# EAGLE design SparkFun_PiMicro-RP2040 (EAGLE 9.6.2)
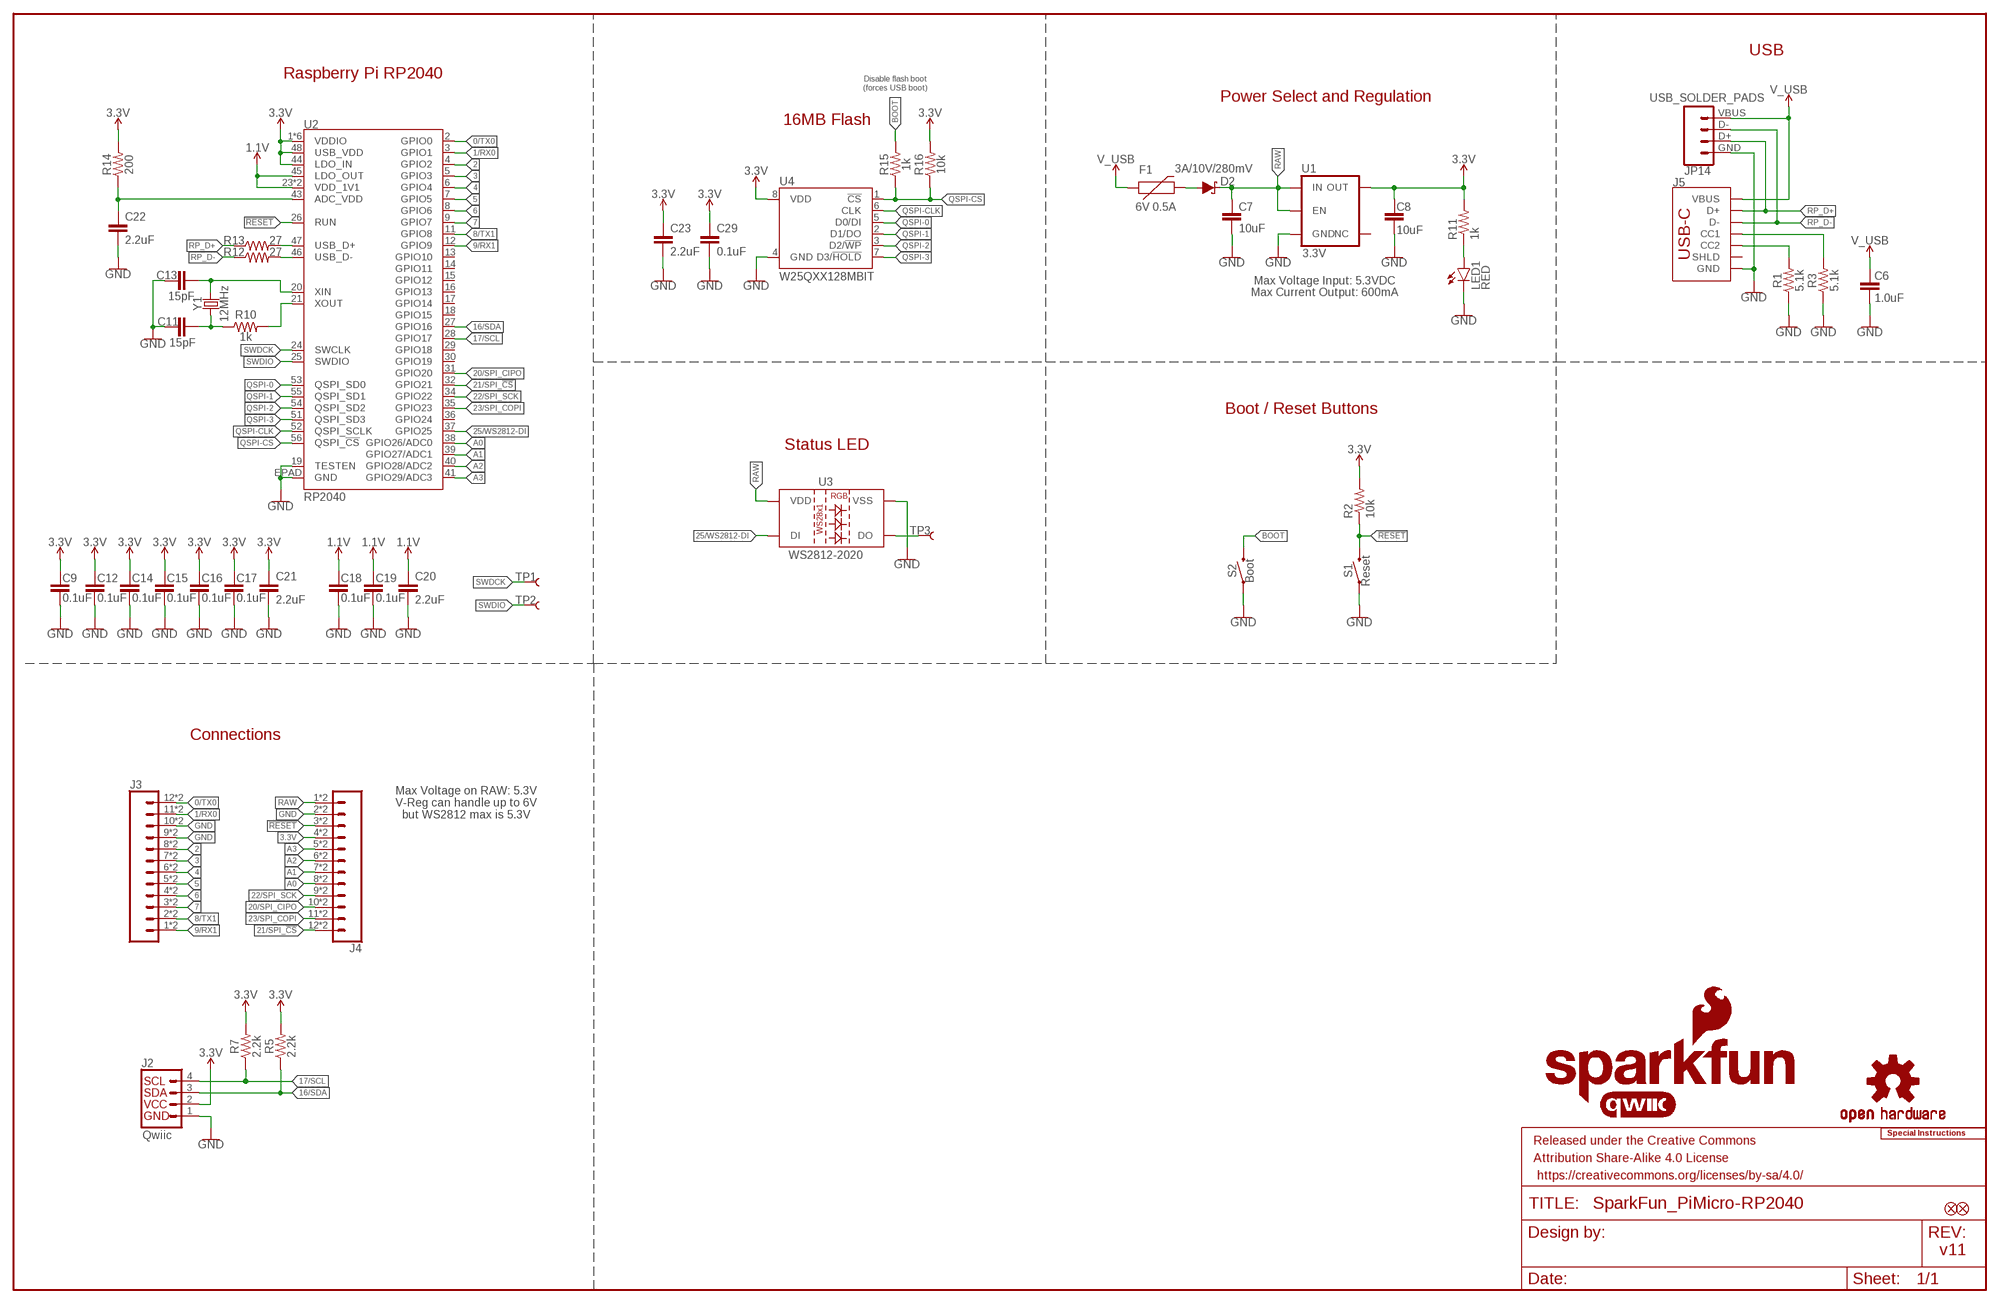
[diagram p0: schematic, sheet 1]

## Parts
C6  1.0uF  1.0UF-0402T-16V-10%  [0402-TIGHT]
C7  10uF  10UF-0402T-6.3V-20%  [0402-TIGHT]
C8  10uF  10UF-0402T-6.3V-20%  [0402-TIGHT]
C9  0.1uF  0.1UF-0402T-6.3V-10%-X7R  [0402-TIGHT]
C11  15pF  15PF-0402T-50V-5%  [0402-TIGHT]
C12  0.1uF  0.1UF-0402T-6.3V-10%-X7R  [0402-TIGHT]
C13  15pF  15PF-0402T-50V-5%  [0402-TIGHT]
C14  0.1uF  0.1UF-0402T-6.3V-10%-X7R  [0402-TIGHT]
C15  0.1uF  0.1UF-0402T-6.3V-10%-X7R  [0402-TIGHT]
C16  0.1uF  0.1UF-0402T-6.3V-10%-X7R  [0402-TIGHT]
C17  0.1uF  0.1UF-0402T-6.3V-10%-X7R  [0402-TIGHT]
C18  0.1uF  0.1UF-0402T-6.3V-10%-X7R  [0402-TIGHT]
C19  0.1uF  0.1UF-0402T-6.3V-10%-X7R  [0402-TIGHT]
C20  2.2uF  2.2UF-0402_TIGHT-10V-10%-X5R  [0402-TIGHT]
C21  2.2uF  2.2UF-0402_TIGHT-10V-10%-X5R  [0402-TIGHT]
C22  2.2uF  2.2UF-0402_TIGHT-10V-10%-X5R  [0402-TIGHT]
C23  2.2uF  2.2UF-0402_TIGHT-10V-10%-X5R  [0402-TIGHT]
C29  0.1uF  0.1UF-0402T-6.3V-10%-X7R  [0402-TIGHT]
D2  3A/10V/280mV  DIODE-SCHOTTKY-BAT60A  [SOD-323]
F1  6V 0.5A  PPTC_6V500MA  [0805]
FRAME2  FRAME-LEDGER  [CREATIVE_COMMONS]
J2  Qwiic  QWIIC_CONNECTORJS-1MM  [JST04_1MM_RA]
J3  CONN_12CASTLE  [1X12_CASTELLATED]
J4  CONN_12CASTLE  [1X12_CASTELLATED]
J5  USB Female Type C Connector  USB_C_4-LAYER_PADS  [USB-C-16P_4LAYER-PADS]
JP1  FIDUCIAL1X2  [FIDUCIAL-1X2]
JP2  FIDUCIAL1X2  [FIDUCIAL-1X2]
JP14  USB_SOLDER_PADS  [USB-SOLDER-PADS]
LED1  RED  LED-RED0603  [LED-0603]
LOGO1  SFE_LOGO_NAME_FLAME.1_INCH  [SFE_LOGO_NAME_FLAME_.1]
LOGO3  QWIIC_LOGO_6MM  [QWIIC_6MM]
LOGO4  SFE_LOGO_FLAME.1_INCH  [SFE_LOGO_FLAME_.1]
LOGO5  SPECIAL_INSTRUCTIONS-ORDERING  [ORDERING_INSTRUCTIONS]
R1  5.1k  5.1KOHM-0402T-1/16W-1%  [0402-TIGHT]
R2  10k  10KOHM-0402T-1/16W-1%  [0402-TIGHT]
R3  5.1k  5.1KOHM-0402T-1/16W-1%  [0402-TIGHT]
R5  2.2k  2.2KOHM-0402T-1/16W-1%  [0402-TIGHT]
R7  2.2k  2.2KOHM-0402T-1/16W-1%  [0402-TIGHT]
R10  1k  1KOHM-0402T-1/16W-1%  [0402-TIGHT]
R11  1k  1KOHM-0402T-1/16W-1%  [0402-TIGHT]
R12  27  27OHM  [0402-TIGHT]
R13  27  27OHM  [0402-TIGHT]
R14  200  200OHM-0402T-1/16W-1%  [0402-TIGHT]
R15  1k  1KOHM-0402T-1/16W-1%  [0402-TIGHT]
R16  10k  10KOHM-0402T-1/16W-1%  [0402-TIGHT]
S1  Reset  MOMENTARY-SWITCH-SPST-SMD-4.6X2.8MM  [TACTILE_SWITCH_SMD_4.6X2.8MM]
S2  Boot  MOMENTARY-SWITCH-SPST-SMD-4.6X2.8MM  [TACTILE_SWITCH_SMD_4.6X2.8MM]
TP1  TEST-POINT3X5  [PAD.03X.05]
TP2  TEST-POINT3X5  [PAD.03X.05]
TP3  TEST-POINT3X5  [PAD.03X.05]
U1  3.3V  V_REG_AP2112K-3.3V  [SOT23-5]
U2  RP2040  [QFN-56]
U3  WS2812-2020  [WS2812-2020]
U4  W25QXX128MBIT  W25QXX128MBIT-6X5-SKINNY_CENTER  [WSON-8-6X5-SKINNY_CENTERPAD]
U$3  OSHW-LOGOMINI  [OSHW-LOGO-MINI]
Y1  12MHz  CRYSTAL-12MHZ  [CRYSTAL-SMD-2X2.5MM]

## Nets
0/TX0: J3.12 J3.12B U2.2(GPIO0)
1.1V: C18.1 C19.1 C20.1 U2.23(VDD_1V1) U2.45(LDO_OUT) U2.50(VDD_1V1)
1/RX0: J3.11 J3.11B U2.3(GPIO1)
2: J3.8 J3.8B U2.4(GPIO2)
3: J3.7 J3.7B U2.5(GPIO3)
3.3V: C8.2 C9.1 C12.1 C14.1 C15.1 C16.1 C17.1 C21.1 C23.1 C29.1 J2.2 J4.4 J4.4B R2.2 R5.2 R7.2 R11.2 R14.2 R16.2 U1.5(OUT) U2.1(VDDIO) U2.10(VDDIO) U2.22(VDDIO) U2.33(VDDIO) U2.42(VDDIO) U2.44(LDO_IN) U2.48(USB_VDD) U2.49(VDDIO) U4.8(VDD)
4: J3.6 J3.6B U2.6(GPIO4)
5: J3.5 J3.5B U2.7(GPIO5)
6: J3.4 J3.4B U2.8(GPIO6)
7: J3.3 J3.3B U2.9(GPIO7)
8/TX1: J3.2 J3.2B U2.11(GPIO8)
9/RX1: J3.1 J3.1B U2.12(GPIO9)
16/SDA: J2.3 R5.1 U2.27(GPIO16)
17/SCL: J2.4 R7.1 U2.28(GPIO17)
20/SPI_CIPO: J4.10 J4.10B U2.31(GPIO20)
21/SPI_!CS!: J4.12 J4.12B U2.32(GPIO21)
22/SPI_SCK: J4.9 J4.9B U2.34(GPIO22)
23/SPI_COPI: J4.11 J4.11B U2.35(GPIO23)
25/WS2812-DI: U2.37(GPIO25) U3.3(DI)
!RESET!: J4.3 J4.3B R2.1 S1.3 S1.4 U2.26(RUN)
A0: J4.8 J4.8B U2.38(GPIO26/ADC0)
A1: J4.7 J4.7B U2.39(GPIO27/ADC1)
A2: J4.6 J4.6B U2.40(GPIO28/ADC2)
A3: J4.5 J4.5B U2.41(GPIO29/ADC3)
ADC_VDD: C22.1 R14.1 U2.43(ADC_VDD)
BOOT: R15.2 S2.3 S2.4
GND: C6.1 C7.1 C8.1 C9.2 C11.1 C12.2 C13.1 C14.2 C15.2 C16.2 C17.2 C18.2 C19.2 C20.2 C21.2 C22.2 C23.2 C29.2 J2.1 J3.9 J3.9B J3.10 J3.10B J4.2 J4.2B J5.GND J5.GND2(GND) JP14.GND LED1.C R1.1 R3.1 S1.1 S1.2 S2.1 S2.2 U1.2(GND) U2.19(TESTEN) U2.EPAD(GND) U3.2(VSS) U4.4(GND)
N$1: TP3.P$1 U3.1(DO)
N$9: J5.A5(CC1) R3.2
N$10: J5.B5(CC2) R1.2
N$38: LED1.A R11.1
QSPI-0: U2.53(QSPI_SD0) U4.5(D0/DI)
QSPI-1: U2.55(QSPI_SD1) U4.2(D1/DO)
QSPI-2: U2.54(QSPI_SD2) U4.3(D2/!WP!)
QSPI-3: U2.51(QSPI_SD3) U4.7(D3/!HOLD!)
QSPI-CLK: U2.52(QSPI_SCLK) U4.6(CLK)
QSPI-CS: R15.1 R16.1 U2.56(QSPI_!CS!) U4.1(!CS!)
RAW [Power]: C7.2 D2.C J4.1 J4.1B U1.1(IN) U1.3(EN) U3.4(VDD)
RP_D1+: R13.2 U2.47(USB_D+)
RP_D1-: R12.2 U2.46(USB_D-)
RP_D+: J5.A6(D+) J5.B6(D+) JP14.D+ R13.1
RP_D-: J5.A7(D-) J5.B7(D-) JP14.D- R12.1
SWDCK: TP1.P$1 U2.24(SWCLK)
SWDIO: TP2.P$1 U2.25(SWDIO)
USB_RAW [Power]: D2.A F1.2
V_USB [Power]: C6.2 F1.1 J5.VBUS1(VBUS) J5.VBUS2(VBUS) JP14.VBUS
X1A: R10.2 U2.21(XOUT)
X1B: C11.2 R10.1 Y1.P1
X2: C13.2 U2.20(XIN) Y1.P3
Unconnected: J5.SHLD1(SHLD) J5.SHLD2(SHLD) J5.SHLD3(SHLD) J5.SHLD4(SHLD) U1.4(NC) U2.13(GPIO10) U2.14(GPIO11) U2.15(GPIO12) U2.16(GPIO13) U2.17(GPIO14) U2.18(GPIO15) U2.29(GPIO18) U2.30(GPIO19) U2.36(GPIO24)

## Notes on the sheet
- USB
- Raspberry Pi RP2040
- Disable flash boot
  (forces USB boot)
- Power Select and Regulation
- 16MB Flash
- Max Voltage Input: 5.3VDC
- Max Current Output: 600mA
- Boot / Reset Buttons
- Status LED
- Connections
- Max Voltage on RAW: 5.3V
  V-Reg can handle up to 6V
  but WS2812 max is 5.3V
- v11

## Library data of the parts
C6 = SparkFun-Capacitors:1.0UF: 1µF ceramic capacitors A capacitor is a passive two-terminal electrical component used to store electrical energy temporarily in an electric field.; PROD_ID: CAP-12417
C7 C8 = SparkFun-Capacitors:10UF: 10.0µF ceramic capacitors A capacitor is a passive two-terminal electrical component used to store electrical energy temporarily in an electric field.; PROD_ID: CAP-14848
C9 C12 C14-C19 C29 = SparkFun-Capacitors:0.1UF: 0.1µF ceramic capacitors A capacitor is a passive two-terminal electrical component used to store electrical energy temporarily in an electric field.; PROD_ID: CAP-14993
C11 C13 = SparkFun-Capacitors:15PF: 15pF ceramic capacitors A capacitor is a passive two-terminal electrical component used to store electrical energy temporarily in an electric field.; PROD_ID: CAP-13063
C20-C23 = SparkFun-Capacitors:2.2UF: 2.2µF ceramic capacitors A capacitor is a passive two-terminal electrical component used to store electrical energy temporarily in an electric field.; PROD_ID: CAP-14232
D2 = SparkFun-DiscreteSemi:DIODE-SCHOTTKY: Schottky diode A Schottky diode is a semiconductor diode which has a low forward voltage drop and a very fast switching action.; PROD_ID: DIO-14072
F1 = SparkFun-Fuses:PPTC: Resettable Fuse PPTC Resettable Fuse. Really a sort of resistor with a polymeric positive temperature coefficient whose resistance increases dramatically with an increase in temperature. When heated by the power passing through the resistance rises causing the current to be limited, protecting the circuit. This is achieved by the transition of the polymer from a crystalline to an amorphous state where the conductive carbon separates breaking the conductive pathways found in the cool crystalline structure. When a PPTC cools back down it resumes conducting letting the circuit turn back on. SparkFun Products: SparkFun RedBoard - Programmed with Arduino <https://www.sparkfun.com/products/12757> Pro Micro - 5V/16MHz <https://www.sparkfun.com/products/12640> Arduino Pro 328 - 5V/16MHz <https://www.sparkfun.com/products/10915> MP3 Trigger <https://www.sparkfun.com/products/13720>; PROD_ID: RES-13945
FRAME2 = SparkFun-Aesthetics:FRAME-LEDGER: Schematic Frame - Ledger Standard 11x14 US Ledger frame
J2 = SparkFun-Connectors:QWIIC_CONNECTOR: SparkFun I2C Standard Qwiic Connector An SMD 1mm pitch JST connector makes it easy and quick (get it? Qwiic?) to connect I2C devices to each other. The Qwiic system <http://www.sparkfun.com/qwiic> enables fast and solderless connection between popular platforms and various sensors and actuators. We carry 200mm <https://www.sparkfun.com/products/14204>, 100mm <https://www.sparkfun.com/products/14205>, 50mm <https://www.sparkfun.com/products/14206>, and breadboard friendly <https://www.sparkfun.com/products/14207> Qwiic cables. We also offer 10 pcs strips <https://www.sparkfun.com/products/14323> the SMD connectors.; PROD_ID: CONN-13694; VALUE: QWIIC_RIGHT_ANGLE
J3 J4 = Castellated:CONN_12: Multi connection point. Often used as Generic Header-pin footprint for 0.1 inch spaced/style header connections On any of the 0.1 inch spaced packages, you can populate with these: Break Away Headers - Straight <https://www.sparkfun.com/products/116> (PRT-00116) Break Away Male Headers - Right Angle <https://www.sparkfun.com/products/553> (PRT-00553) Female Headers <https://www.sparkfun.com/products/115> (PRT-00115) Break Away Headers - Machine Pin <https://www.sparkfun.com/products/117> (PRT-00117) Break Away Female Headers - Swiss Machine Pin <https://www.sparkfun.com/products/743> (PRT-00743) For SCREWTERMINALS and SPRING TERMINALS visit here: Screw Terimnals on SparkFun.com <https://www.sparkfun.com/search/results?term=Screw+Terminals> (5mm/3.5mm/2.54mm spacing) This device is also useful as a general connection point to wire up your design to another part of your project. Our various solder wires solder well into these plated through hole pads. Hook-Up Wire - Assortment (Stranded, 22 AWG) <https://www.sparkfun.com/products/11375> (PRT-11375) Hook-Up Wire - Assortment (Solid Core, 22 AWG) <https://www.sparkfun.com/products/11367> (PRT-11367) View the entire wire category on our website here <https://www.sparkfun.com/categories/141> Special notes: Molex polarized connector foot print use with SKU : PRT-08231 with associated crimp pins and housings. 1MM SMD Version SKU: PRT-10208 NOTES ON THE VARIANTS LOCK and LOCK_LONGPADS... This footprint was designed to help hold the alignment of a through-hole component (i.e. 6-pin header) while soldering it into place. You may notice that each hole has been shifted either up or down by 0.005 of an inch from it's more standard position (which is a perfectly straight line). This slight alteration caused the pins (the squares in the middle) to touch the edges of the holes. Because they are alternating, it causes a "brace" to hold the component in place. 0.005 has proven to be the perfect amount of "off-center" position when using our standard breakaway headers. Although looks a little odd when you look at the bare footprint, once you have a header in there, the alteration is very hard to notice. Also,if you push a header all the way into place, it is covered up entirely on the bottom side.
J5 = SparkFun-Connectors:USB_C: USB Type C 16Pin Connector Super Speed pins not available on the 16-pin purely SMD connector so this part is best for USB 2.0 implementations. D1 and D2 are tied together enabling D+/- no matter which way the cable is plugged into the connector. The two channel configuration pins (CC1/2) are exposed. These are normally connected to ground via 5.1k resistors but can be reconfigured for high current/high power applications. **4-LAYER BOARD WARNING!!** If designing 4-layer board, make sure to select the variant _4-LAYER-ISOLATED. The linked footprint (USB-C-16-4LAYER-ISOLATED) includes some very necessary cutout polygons in the inner layers (2 and 15). This prevents the PTH mounting shield legs on the USB connector from electrically connecting any other polygons on the inner layers (usually VCC and GND).; PROD_ID: CONN-14122
JP1 JP2 = SparkFun-Aesthetics:FIDUCIAL: Fiducial Alignment Points Point-of-reference for pick-and-place machines and other optical instruments.
JP14 = SparkFun-Connectors:USB_SOLDER_PADS: Solder pad access to USB pins. Helpful to expose on PCBs so user can attach external USB connector if necessary.
LED1 = SparkFun-LED:LED-RED: Red SMD LED Used in manufacturing of most products at SparkFun Packages: 0603 - SMD 0603 package [Product Link] <http://docs.avagotech.com/docs/AV02-0551EN> 0603 SMART - SMD 0603 SMART package ( more efficient and expensive)[Product Link] <http://www.osram-os.com/Graphics/XPic2/00077099_0.pdf> 1206 - SMD1206 package [Product Link] <https://www.sparkfun.com/datasheets/DevTools/LilyPad/Q150OVS4.pdff> SparkFun Products: Pro Mini 328 -5V <https://www.sparkfun.com/products/821> RedBoard <https://www.sparkfun.com/products/12757> IOIO-OTG <https://www.sparkfun.com/products/13613>; PROD_ID: DIO-00819
LOGO1 = SparkFun-Aesthetics:SFE_LOGO_NAME_FLAME: SparkFun Font Logo w/ Flame This is the SparkFun full logo. The logo on the schematic will always be the same size; the package variant is the height of the flame part of the logo. Default layer for the logo on the board is tSilk.
LOGO3 = SparkFun-Aesthetics:QWIIC_LOGO: Qwiic Logos for placement on schematic and PCB. The 5.5mm silk logo is best for placing next to Qwiic connector.
LOGO4 = SparkFun-Aesthetics:SFE_LOGO_FLAME: SparkFun Flame Logo This is the SparkFun flame logo. The logo on the schematic will always be the same size; the package variant is the height of the flame. Default layer for the logo on the board is tSilk.
LOGO5 = SparkFun-Aesthetics:SPECIAL_INSTRUCTIONS: Special Ordering/Production Instructions Alert Symbol for special PCB ordering instructions or unique production process warnings. Ordering Instructions Production Instructions Types of information that should be added to box: Copper weight Soldermask color Silk color PCB thickness Number of layers PCB Standard: 1.6mm FR4 1 oz copper immersion silver plating red soldermask white silkscreen Types of information that should be added to box: Special wash requirements Depaneling instructions Humidification Glue curing Default text settings: 0.07 inch 9% ratio 50% line distance
R1 R3 = SparkFun-Resistors:5.1KOHM; PROD_ID: RES-14340
R2 R16 = SparkFun-Resistors:10KOHM: 10kΩ resistor A resistor is a passive two-terminal electrical component that implements electrical resistance as a circuit element. Resistors act to reduce current flow, and, at the same time, act to lower voltage levels within circuits. - Wikipedia; PROD_ID: RES-14241
R5 R7 = SparkFun-Resistors:2.2KOHM: 2.2kΩ resistor A resistor is a passive two-terminal electrical component that implements electrical resistance as a circuit element. Resistors act to reduce current flow, and, at the same time, act to lower voltage levels within circuits. - Wikipedia; PROD_ID: RES-14341
R10 R11 R15 = SparkFun-Resistors:1KOHM: 1kΩ resistor A resistor is a passive two-terminal electrical component that implements electrical resistance as a circuit element. Resistors act to reduce current flow, and, at the same time, act to lower voltage levels within circuits. - Wikipedia; PROD_ID: RES-14342
R12 R13 = SparkFun-Resistors:27OHM: 27Ω resistor A resistor is a passive two-terminal electrical component that implements electrical resistance as a circuit element. Resistors act to reduce current flow, and, at the same time, act to lower voltage levels within circuits. - Wikipedia; PROD_ID: RES-15238
R14 = SparkFun-Resistors:200OHM: 200Ω resistor A resistor is a passive two-terminal electrical component that implements electrical resistance as a circuit element. Resistors act to reduce current flow, and, at the same time, act to lower voltage levels within circuits. - Wikipedia; PROD_ID: RES-15550
S1 S2 = SparkFun-Switches:MOMENTARY-SWITCH-SPST: Momentary Switch (Pushbutton) - SPST Normally-open (NO) SPST momentary switches (buttons, pushbuttons). Variants PTH-12MM - 12mm square, through-hole Momentary Pushbutton Switch - 12mm Square <https://www.sparkfun.com/products/9190> (COM-09190) PTH-6.0MM, PTH-6.0MM-KIT - 6.0mm square, through-hole Mini Pushbutton Switch <https://www.sparkfun.com/products/97> (COM-00097) KIT package intended for soldering kit's - only one side of pads' copper is exposed. PTH-RIGHT-ANGLE-KIT - Right-angle, through-hole Right Angle Tactile Button <https://www.sparkfun.com/products/10791> - Used on SparkFun BigTime Watch Kit <https://www.sparkfun.com/products/11734> SMD-12MM - 12mm square, surface-mount Tactile Button - SMD (12mm) <https://www.sparkfun.com/products/12993> (COM-12993) Used on SparkFun PicoBoard <https://www.sparkfun.com/products/11888> SMD-4.5MM - 4.5mm Square Trackball Switch Used on SparkFun Blackberry Trackballer Breakout <https://www.sparkfun.com/products/13169> SMD-4.6MMX2.8MM - 4.60mm x 2.80mm, surface mount Used on SparkFun SAMD21 Mini Breakout <https://www.sparkfun.com/products/13664> SMD-5.2MM, SMD-5.2-REDUNDANT - 5.2mm square, surface-mount Mini Pushbutton Switch - SMD <https://www.sparkfun.com/products/8720> (COM-08720) Used on Arduino Pro Mini <https://www.sparkfun.com/products/11114> REDUNDANT package connects both switch circuits together SMD-6.0X3.5MM - 6.0 x 3.5mm, surface mount Momentary Reset Switch SMD <https://www.sparkfun.com/products/8229> (COM-08229) SMD-6.2MM-TALL - 6.2mm square, surface mount Tactile Button - SMD (6mm) <https://www.sparkfun.com/products/12992> Used on SparkFun Digital Sandbox <https://www.sparkfun.com/products/12651> SMD-RIGHT-ANGLE - Right-angle, surface mount Used on SparkFun Block for Intel® Edison - Arduino <https://www.sparkfun.com/products/13036>; PROD_ID: SWCH-15606
TP1-TP3 = SparkFun-Connectors:TEST-POINT: SparkFun Test Points Bare copper test points for troubleshooting or In-Circuit-Testing. These are used by our Production team for verifying production board runs using pogo-pins on test beds. SparkFun Products: SparkFun LSM9DS1 Breakout <https://www.sparkfun.com/products/13284> SparkFun PSOC <https://www.sparkfun.com/products/13714> SparkFun Load Cell Amplifier <https://www.sparkfun.com/products/13879>
U1 = SparkFun-IC-Power:V_REG_AP2112: AP2112 - 600mA CMOS LDO Regulator w/ Enable The AP2112 is CMOS process low dropout linear regulator with enable function, the regulator delivers a guaranteed 600mA (min.) continuous load current. Features Output Voltage Accuracy: ±1.5% Output Current: 600mA (Min.) Foldback Short Current Protection: 50mA Enable Function to Turn ON/OFF VOUT Low Dropout Voltage (3.3V): 250mV (Typ.) @IOUT=600mA Excellent Load Regulation: 0.2%/A (Typ.) Excellent Line Regulation: 0.02%/V (Typ.) Low Quiescent Current: 55μA (Typ.) Low Standby Current: 0.01μA (Typ.) Low Output Noise: 50μVRMS PSRR: 100Hz -65dB, 1kHz -65dB OTSD Protection Stable with 1.0μF Flexible Cap: Ceramic, Tantalum and Aluminum Electrolytic Operation Temperature Range: -40°C to 85°C ESD: MM 400V, HBM 4000V; PROD_ID: VREG-12457
U2 = RP2040:RP2040: Raspberry Pi RP2040 MCU 56-pin 32-bit Microcontroller with 264kB of SRAM and external flash support up to 16MB Getting Started with the RP2040 <https://pico.raspberrypi.org/getting-started/> Dual-core ARM Cortex M0+ processor, flexible clock running up to 133 MHz 264kB of SRAM, and QSPI control of common flash memory USB 1.1 Host and Device support Low-power sleep and dormant modes Drag & drop programming using mass storage over USB 26 multi-function GPIO pins 2×SPI, 2×I2C, 2×UART, 3×12-bit ADC, 16×controllable PWM channels Accurate clock and timer on-chip Temperature sensor Accelerated floating point libraries on-chip 8×Programmable IO (PIO) state machines for custom peripheral support; PROD_ID: IC-15502
U3 = SparkFun-LED:WS2812-2020; PROD_ID: DIO-15591
U4 = SparkFun-IC-Memory:W25QXX; PROD_ID: IC-15107
U$3 = SparkFun-Aesthetics:OSHW-LOGO: Open-Source Hardware (OSHW) Logo This logo indicates the piece of hardware it is found on incorporates a OSHW license and/or adheres to the definition of open source hardware found here: http://freedomdefined.org/OSHW
Y1 = SparkFun-Clocks:CRYSTAL-12MHZ: 12.0MHz Crystal Frequency: 12.0MHz Frequency Tolerance: ±20ppm Load Capacitance: 18pF SparkFun Products: SparkFun Logomatic <https://www.sparkfun.com/products/12772> Pocket AVR Programmer <https://www.sparkfun.com/products/9825>; PROD_ID: XTAL-15540

## Net classes
1 Power: width 0.127 mm, clearance 0.178 mm

## Board
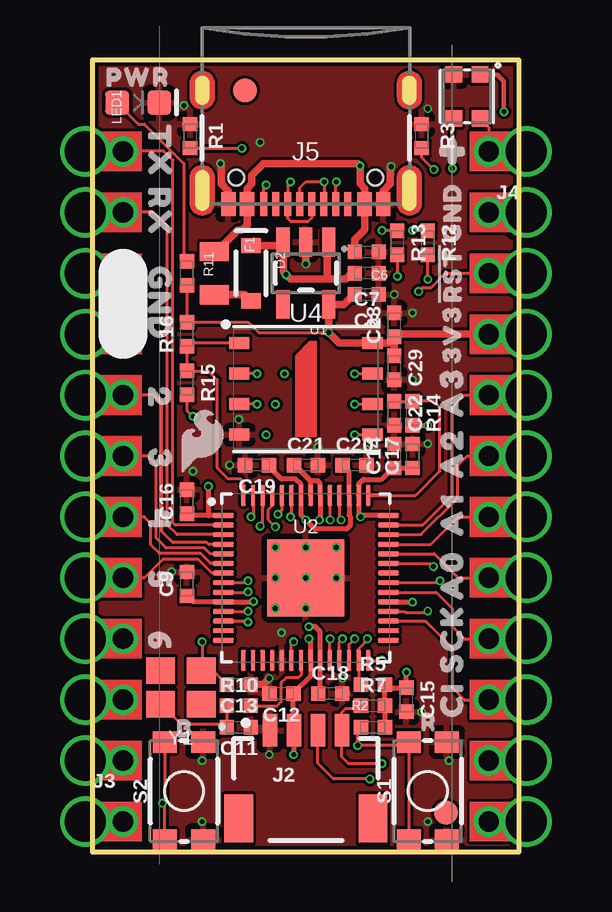
[diagram p1: board, top side]
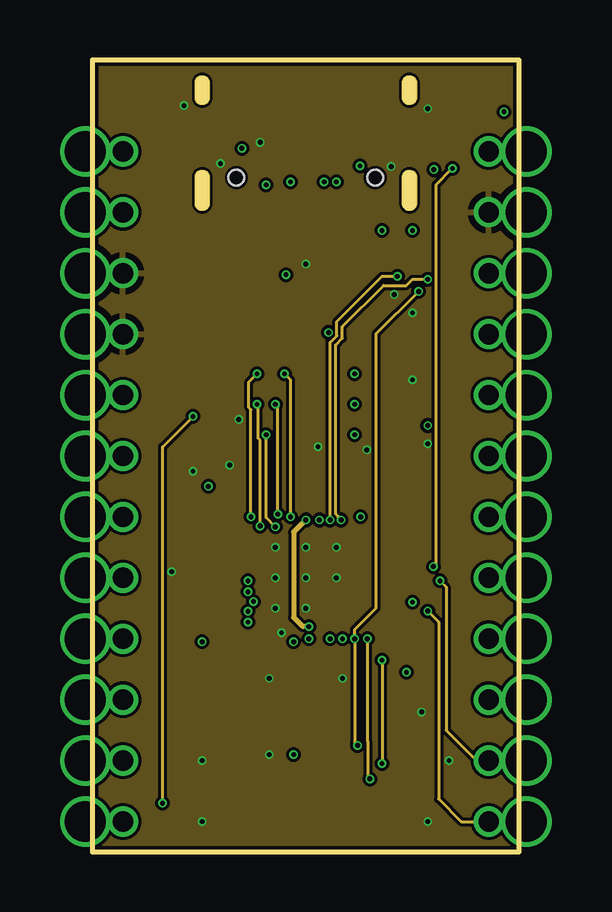
[diagram p2: board, inner layer GND/Vert]
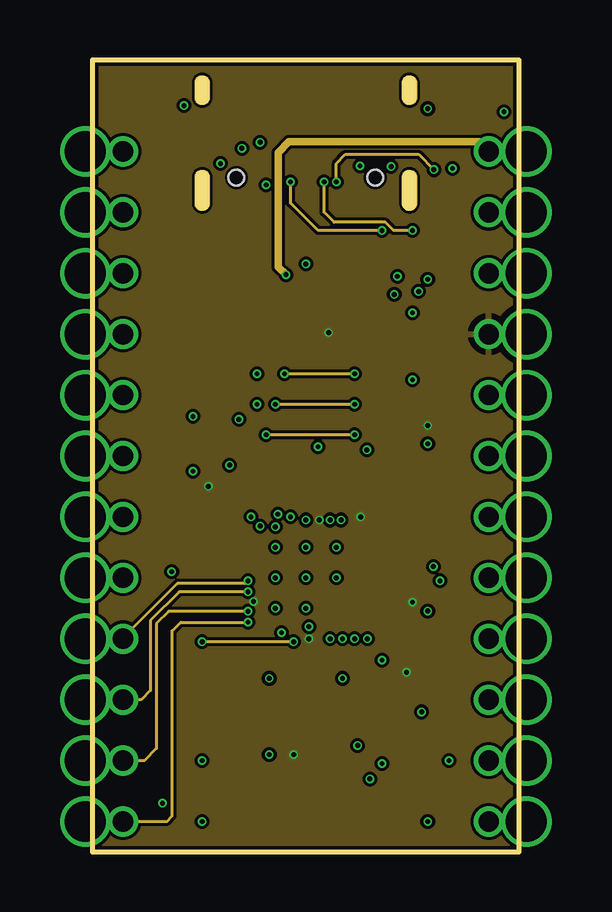
[diagram p3: board, inner layer 3.3V/Horz]
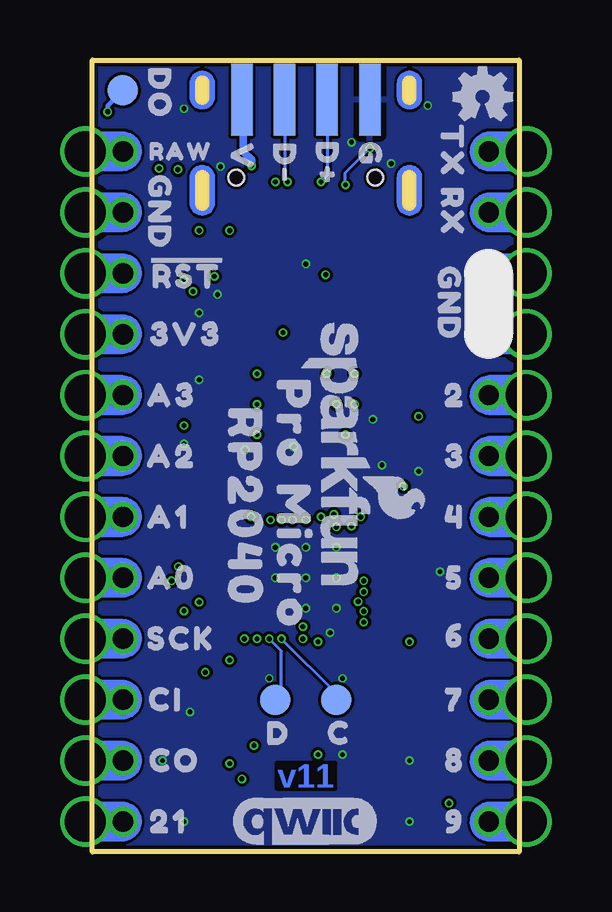
[diagram p4: board, bottom side, seen from below]

Size 17.78 x 33.02 mm. Coordinates in mm from the lower left corner, seen from the top.
Outline: 0,33.02 0,0 17.78,0 17.78,33.02 0,33.02
Copper layers (1+2*15+16): Top 0.035mm / dielectric 1.5mm / GND/Vert 0.035mm / dielectric 0.15mm / 3.3V/Horz 0.035mm / dielectric 0.2mm / Bottom 0.035mm
Design rules "SparkFun-4-layer-MicroMod *": minimum track width 4mil, minimum drill 0.2mm, track to track 4mil, track to pad 4mil, pad to pad 4mil, via to via 4mil, smd to smd 4mil, copper to edge 6mil, drill to drill 6mil, minimum pad ring 3mil, minimum via ring 3mil, stop-mask expansion 4mil, vias tented up to drill 25mil, thermal gap 10mil

### Footprints (pad centres in the part's own frame; a part is rotated, then mirrored left to right if it is on the bottom)
0402-TIGHT = smd 0.6 x 0.6: 1 -0.5,0; 2 0.5,0
SOD-323 = smd 0.63 x 0.83: A 1.15,0; C -1.15,0
0805 = smd 0.8 x 1.2: 1 -0.9,0; 2 0.9,0
JST04_1MM_RA = smd 0.6 x 1.35: 1 -1.5,0; 2 -0.5,0; 3 0.5,0; 4 1.5,0 | smd 1.2 x 2: NC1 2.8,-3.675; NC2 -2.8,-3.675
1X12_CASTELLATED = drill 0.85 pad 1.016: 1 0,0; 2 0,2.54; 3 0,5.08; 4 0,7.62; 5 0,10.16; 6 0,12.7; 7 0,15.24; 8 0,17.78; 9 0,20.32; 10 0,22.86; 11 0,25.4; 12 0,27.94 | drill 1.7 pad 1.75: 1B -1.57,0; 2B -1.57,2.54; 3B -1.57,5.08; 4B -1.57,7.62; 5B -1.57,10.16; 6B -1.57,12.7; 7B -1.57,15.24; 8B -1.57,17.78; 9B -1.57,20.32; 10B -1.57,22.86; 11B -1.57,25.4; 12B -1.57,27.94
USB-C-16P_4LAYER-PADS = smd 0.3 x 1: A5 -1.25,-0.34; A6 -0.25,-0.34; A7 0.25,-0.34; A8 1.25,-0.34; B5 1.75,-0.34; B6 0.75,-0.34; B7 -0.75,-0.34; B8 -1.75,-0.34 | smd 0.6 x 1: GND -3.225,-0.34; GND2 3.225,-0.34; VBUS1 -2.45,-0.34; VBUS2 2.45,-0.34 | drill 0.4 pad 0.6 long: SHLD1 -4.318,-0.915; SHLD2 4.318,-0.915; SHLD3 -4.318,-5.095; SHLD4 4.318,-5.095 | hole 0.65: -2.89,-1.445; 2.89,-1.445
FIDUCIAL-1X2 = smd 1 x 1: 1 0,0
USB-SOLDER-PADS = smd 3 x 0.9: D+ 0,-0.889; D- 0,0.889; GND 0,-2.667; VBUS 0,2.667
LED-0603 = smd 1 x 1: A -0.877,0; C 0.877,0
TACTILE_SWITCH_SMD_4.6X2.8MM = smd 0.9 x 1: 1 -2.05,-0.8; 2 2.05,-0.8; 3 2.05,0.8; 4 -2.05,0.8
PAD.03X.05 = smd 1.27 x 1.27: P$1 0,0
SOT23-5 = smd 0.55 x 1.2: 1 -0.95,-1.3; 2 0,-1.3; 3 0.95,-1.3; 4 0.95,1.3; 5 -0.95,1.3
QFN-56 = smd 0.875 x 0.2: 1 -3.437,2.6; 2 -3.437,2.2; 3 -3.437,1.8; 4 -3.437,1.4; 5 -3.437,1; 6 -3.437,0.6; 7 -3.437,0.2; 8 -3.437,-0.2; 9 -3.437,-0.6; 10 -3.437,-1; 11 -3.437,-1.4; 12 -3.437,-1.8; 13 -3.437,-2.2; 14 -3.437,-2.6; 29 3.437,-2.6; 30 3.437,-2.2; 31 3.437,-1.8; 32 3.437,-1.4; 33 3.437,-1; 34 3.437,-0.6; 35 3.437,-0.2; 36 3.437,0.2; 37 3.437,0.6; 38 3.437,1; 39 3.437,1.4; 40 3.437,1.8; 41 3.437,2.2; 42 3.437,2.6 | smd 0.2 x 0.875: 15 -2.6,-3.437; 16 -2.2,-3.437; 17 -1.8,-3.437; 18 -1.4,-3.437; 19 -1,-3.437; 20 -0.6,-3.437; 21 -0.2,-3.437; 22 0.2,-3.437; 23 0.6,-3.437; 24 1,-3.437; 25 1.4,-3.437; 26 1.8,-3.437; 27 2.2,-3.437; 28 2.6,-3.437; 43 2.6,3.437; 44 2.2,3.437; 45 1.8,3.437; 46 1.4,3.437; 47 1,3.437; 48 0.6,3.437; 49 0.2,3.437; 50 -0.2,3.437; 51 -0.6,3.437; 52 -1,3.437; 53 -1.4,3.437; 54 -1.8,3.437; 55 -2.2,3.437; 56 -2.6,3.437 | smd 3.2 x 3.2: EPAD 0,0
WS2812-2020 = smd 0.7 x 0.7: 1 0.915,-0.55; 2 0.915,0.55; 3 -0.915,0.55; 4 -0.915,-0.55
WSON-8-6X5-SKINNY_CENTERPAD = smd 0.85 x 0.5: 1 -2.775,1.905; 2 -2.775,0.635; 3 -2.775,-0.635; 4 -2.775,-1.905; 5 2.775,-1.905; 6 2.775,-0.635; 7 2.775,0.635; 8 2.775,1.905
CRYSTAL-SMD-2X2.5MM = smd 1.2 x 1.1: P1 0.846,0.69; P2 -0.854,0.69; P3 -0.854,-0.71; P4 0.846,-0.71

### Placement (x,y rotation side)
C6  11.43,25.02 180 top
C7  11.43,24.13 180 top
C8  11.43,23.24 180 top
C9  3.94,11.18 90 top
C11  6.1,5.21 180 top
C12  7.87,6.6 180 top
C13  6.1,6.99 180 top
C14  12.57,16.51 90 top
C15  13.08,6.35 270 top
C16  3.94,14.61 90 top
C17  13.34,16.51 90 top
C18  9.91,6.6 0 top
C19  6.86,16.13 180 top
C20  10.92,16.13 0 top
C21  8.89,16.13 0 top
C22  12.57,18.29 270 top
C23  12.57,21.97 90 top
C29  12.57,20.19 270 top
D2  6.6,24.13 270 top
F1  5.08,24.13 270 top
FRAME2  15.24,-24.13 0 top  (outside the outline)
J2  8.89,5.08 0 top
J3  1.27,1.27 0 top
J4  16.51,29.21 180 top
J5  8.89,26.67 180 top
JP1  14.73,1.65 0 top
JP2  6.35,31.75 0 top
JP14  8.89,31.37 90 bottom
LED1  1.91,31.24 0 top
LOGO1  7.62,16.51 270 bottom
LOGO3  8.89,1.27 0 bottom
LOGO4  4.57,17.14 0 top
LOGO5  22.86,50.8 0 top  (outside the outline)
R1  4.06,29.84 270 top
R2  11.68,5.21 0 top
R3  13.72,29.84 270 top
R5  11.68,6.99 0 top
R7  11.68,6.1 0 top
R10  6.1,6.1 0 top
R11  3.94,24.13 270 top
R12  13.97,25.4 270 top
R13  12.7,25.4 270 top
R14  13.34,18.29 270 top
R15  3.94,19.56 270 top
R16  3.94,21.59 90 top
S1  13.97,2.54 90 top
S2  3.81,2.54 90 top
TP1  7.62,6.35 0 bottom
TP2  10.16,6.35 0 bottom
TP3  16.51,31.75 0 bottom
U1  8.89,24.13 180 top
U2  8.89,11.43 0 top
U3  15.6,31.5 90 top
U4  8.89,19.3 0 top
U$1  [A00]  14.99,11.56 90 top
U$2  [GND_0]  14.99,26.8 90 top
U$3  1.52,31.5 0 bottom
U$4  [PRO_MICRO0]  9.4,14.48 270 bottom
U$5  [#0]  15.1,29.2 0 top
U$6  [70]  2.67,6.35 0 bottom
U$7  [81]  2.67,3.81 0 bottom
U$8  [92]  2.67,1.27 0 bottom
U$9  [CI4]  14.73,6.35 0 bottom
U$10  [SCK3]  14.1,8.89 0 bottom
U$11  [A00]  14.48,11.43 0 bottom
U$12  [A10]  14.61,13.97 0 bottom
U$13  [A21]  14.48,16.51 0 bottom
U$14  [A32]  14.48,19.05 0 bottom
U$15  [GND2]  14.99,26.67 270 bottom
U$16  [3V3_0]  13.72,21.59 0 bottom
U$17  [RAW0]  14.1,29.21 0 bottom
U$18  [C0]  7.49,4.95 0 bottom
U$19  [TX0]  2.79,29.21 270 bottom
U$20  [A10]  14.99,14.1 90 top
U$21  [RX1]  2.79,26.67 270 bottom
U$22  [GND2]  2.92,22.86 270 bottom
U$23  [20]  2.67,19.05 0 bottom
U$24  [31]  2.67,16.51 0 bottom
U$25  [42]  2.67,13.97 0 bottom
U$26  [53]  2.67,11.43 0 bottom
U$27  [64]  2.67,9.02 0 bottom
U$28  [D#1]  8,28.7 270 bottom
U$29  [D#2]  9.78,28.7 270 bottom
U$30  [G0]  6.22,29.08 270 bottom
U$31  [V3]  11.56,28.96 270 bottom
U$32  [210]  14.61,1.27 0 bottom
U$33  [A21]  14.99,16.64 90 top
U$34  [#RST#0]  13.84,24.13 0 bottom
U$35  [D1]  10.03,4.95 0 bottom
U$36  [B0]  3.86,5.16 0 top
U$37  [R0]  14.02,5.41 0 top
U$38  [RP20401]  11.43,14.35 270 bottom
U$39  [A32]  14.99,19.18 90 top
U$40  [DO0]  14.99,31.62 270 bottom
U$53  [20]  2.79,18.92 270 top
U$54  [31]  2.79,16.38 270 top
U$55  [42]  2.79,13.84 270 top
U$56  [53]  2.79,11.3 270 top
U$57  [64]  2.79,8.76 270 top
U$64  [CI4]  14.99,6.35 90 top
U$66  [CO5]  14.35,3.81 0 bottom
U$67  [SCK3]  14.99,8.89 90 top
U$68  [#RST#1]  14.9,24.1 90 top
U$69  [3V30]  14.99,21.59 90 top
U$73  [PWR0]  1.9,32.3 0 top
U$74  [GND2]  2.79,22.86 270 top
U$75  [RX1]  2.79,26.67 270 top
U$76  [TX0]  2.79,29.21 270 top
Y1  3.68,6.86 180 top

### Tracks (layer width: path | path; a pad name or v marks a point on that pad's centre or on a via)
0/TX0
  Top 0.127: U2.2 3.45,13.63 3.35,13.74 3.35,28.84 2.98,29.21 J3.12
  3.3V/Horz 0.127: J3.12B J3.12
1.1V  (via drill 0.2)
  Top 0.127: 7.36,16.06 C19.1 | 9.49,6.69 C18.1
  Top 0.203: 7.36,16.06 7.87,15.54 8.46,15.54 8.69,15.31 U2.50 8.69,14.04 v8.89,13.84 9.27,13.46 10.59,13.46 10.74,13.61 10.74,14 10.69,14.05 U2.45 10.69,15.86 C20.1 | 9.49,6.69 U2.23 9.49,9.18 9.27,9.4 v9.02,9.4
  GND/Vert 0.203: v9.02,9.4 8.76,9.4 8.38,9.78 8.38,13.34 v8.89,13.84
1/RX0
  Top 0.127: J3.11 2.54,26.67 3.12,26.09 3.12,13.64 3.53,13.23 U2.3
  3.3V/Horz 0.127: J3.11B J3.11
2
  Top 0.127: U2.4 4.83,12.83 4.76,12.9 3.35,12.9 2.89,13.37 2.89,18.7 2.54,19.05 J3.8 J3.8B
3
  Top 0.127: U2.5 4.91,12.43 4.67,12.68 3.07,12.68 2.66,13.09 2.66,16.14 2.29,16.51 J3.7 J3.7B
3.3V  (via drill 0.2)
  Top 0.127: 4.01,14.03 C16.1 | R5.2 12.32,6.85 | J2.2 8.37,5.1 | 8.39,4.07 v8.38,4.06 | R11.2 R16.2 6.49,22.09 6.92,21.66 v9.84,21.66 | 10.89,23.24 C8.2 | C23.1 12.69,21.59 | J4.4B J4.4 | 8.43,16.13 C21.1 | v6.7,10.43 v6.71,10.44 | v13.96,17.79 v13.97,17.78
  Top 0.203: U2.1 4.83,14.03 | 4.83,14.03 4.01,14.03 | R5.2 R7.2 R2.2 | 12.32,6.85 C15.1 v13.08,7.49 | U2.33 13.32,10.43 v13.34,10.41 | v9.02,8.89 9.09,8.82 U2.22 9.09,7.32 C12.1 8.37,5.1 | J2.2 8.39,4.07 | C9.1 4.18,10.43 U2.10 v6.7,10.43 | U2.42 11.24,14.03 v11.18,13.97 11.09,14.06 U2.44 11.09,15.34 11.29,15.54 12.04,15.54 12.52,16.01 C14.1 C17.1 | v4.83,15.24 4.83,14.03 | R14.2 v13.96,17.79 | v9.45,13.84 9.49,13.88 U2.48 9.49,15.37 9.39,15.47 9.09,15.47 | U2.49 9.09,15.47 | 9.09,15.47 8.43,16.13
  Top 0.305: 10.89,23.24 10.47,22.83 U1.5 v9.84,21.66 10.29,21.21 U4.8 12.57,21.21 | 12.69,21.59 J4.4 | C29.1 12.57,21.21 | 12.57,21.21 C23.1
  pour 3.3V/Horz (isolate 0.127): 0,33.02 17.78,33.02 17.78,0 0,0
4
  Top 0.127: J3.6B J3.6 2.16,13.97 2.43,13.7 2.43,12.81 2.79,12.45 4.51,12.45 4.93,12.03 U2.6
5
  Top 0.127: J3.5B J3.5 2.16,11.43 2.92,12.19 4.42,12.19 4.98,11.63 U2.7
6  (via drill 0.2)
  Top 0.127: U2.8 6.4,11.23 v6.48,11.3 | J3.4B J3.4
  3.3V/Horz 0.127: v6.48,11.3 6.36,11.19 3.54,11.19 1.27,8.92 J3.4
7  (via drill 0.2)
  Top 0.127: U2.9 6.46,10.83 v6.48,10.85 | J3.3B J3.3
  3.3V/Horz 0.127: v6.48,10.85 3.61,10.85 2.41,9.65 2.41,6.73 2.03,6.35 J3.3
8/TX1  (via drill 0.2)
  Top 0.127: U2.11 v6.47,10.03 v6.48,10.03 | J3.2B J3.2
  3.3V/Horz 0.127: v6.48,10.03 3.17,10.03 2.67,9.53 2.67,4.32 2.16,3.81 J3.2
9/RX1  (via drill 0.2)
  Top 0.127: U2.12 6.43,9.63 v6.48,9.58 | J3.1B J3.1
  3.3V/Horz 0.127: J3.1 3.09,1.27 3.32,1.5 3.32,9.22 3.68,9.58 v6.48,9.58
16/SDA  (via drill 0.2)
  Top 0.127: R5.1 11.09,7.08 U2.27 11.09,8.47 11.34,8.72 11.34,8.78 v11.45,8.89 | v11.56,3.05 10.03,3.05 9.39,3.69 J2.3
  GND/Vert 0.127: v11.45,8.89 11.45,4.63 11.47,4.62 11.47,3.14 v11.56,3.05
17/SCL  (via drill 0.2)
  Top 0.127: U2.28 v12.06,7.99 v12.06,8 | v12.06,3.68 10.67,3.68 10.39,3.96 J2.4 10.39,5.82 10.54,5.97 11.06,5.97 R7.1
  GND/Vert 0.127: v12.06,8 v12.06,3.68
20/SPI_CIPO
  Top 0.127: U2.31 13.87,9.63 14.99,8.51 14.99,6.86 15.49,6.35 J4.10 J4.10B
21/SPI_!CS!  (via drill 0.2)
  Top 0.127: U2.32 13,10.03 13.04,10 13.92,10 v13.97,10.05 | J4.12B J4.12
  GND/Vert 0.127: v13.97,10.05 14.43,9.59 14.43,2.21 15.37,1.27 J4.12
22/SPI_SCK
  Top 0.127: U2.34 13.03,10.83 13.04,10.83 14.31,10.83 14.99,10.16 14.99,9.4 15.49,8.89 J4.9 J4.9B
23/SPI_COPI  (via drill 0.2)
  Top 0.127: U2.35 14.4,11.23 v14.48,11.3 | J4.11B J4.11
  GND/Vert 0.127: v14.48,11.3 14.73,11.05 14.73,5.08 16,3.81 J4.11
25/WS2812-DI  (via drill 0.2)
  Top 0.127: U2.37 14.07,12.03 v14.2,11.9 | v15,28.5 15,30.54 U3.3
  GND/Vert 0.127: v14.2,11.9 14.31,12.01 14.31,27.81 v15,28.5
!RESET!  (via drill 0.2)
  Top 0.127: U2.26 10.69,8.66 v10.92,8.89 | R2.1 11.05,5.07 v11.05,4.45 13.03,4.45 S1.3 S1.4 | J4.3B J4.3 14.71,24.13 14.11,23.54 13.76,23.54 v13.59,23.37
  GND/Vert 0.127: v11.05,4.45 10.92,4.57 v10.92,8.89 10.92,9.27 11.81,10.16 11.81,21.59 v13.59,23.37
A0
  Top 0.127: U2.38 14.24,12.43 15.24,11.43 J4.8 J4.8B
A1
  Top 0.127: U2.39 14.1,12.83 15.24,13.97 J4.7 J4.7B
A2
  Top 0.127: U2.40 13.68,13.23 15.21,14.76 15.21,16.1 15.62,16.51 J4.6 J4.6B
A3
  Top 0.127: U2.41 13.76,13.63 14.99,14.86 14.99,18.54 15.49,19.05 J4.5 J4.5B
ADC_VDD
  Top 0.127: U2.43 13.47,14.87 14.48,15.88 14.48,18.54 14.22,18.8 R14.1 C22.1
BOOT  (via drill 0.2)
  Top 0.127: S2.4 3.01,1.94 v2.92,2.03 3.01,2.12 S2.3 | R15.2 3.94,18.41 v4.19,18.16
  GND/Vert 0.127: v2.92,2.03 2.92,16.89 v4.19,18.16
GND  (via drill 0.2)
  Top 0.305: U1.2 v8.89,24.51 | J5.GND 12.12,27.56 12.41,27.85 12.41,28.54 v12.45,28.57 | J5.GND2 5.67,27.56 5.37,27.85 5.37,28.67 v5.33,28.7 | C13.1 7.11,6.99 v7.37,7.24
  other vias: 4.19,15.88 5.71,16.13 9.4,16.89 11.43,16.76 13.97,17.02 13.34,19.68 13.34,22.48 12.57,23.24 3.81,31.11 6.99,29.59 13.97,30.99 6.1,18.03 7.87,9.14 10.41,7.24 7.37,4.06 4.57,3.81 4.57,1.27 14.86,3.81 13.97,1.27 13.72,5.84 3.3,11.68 7.62,10.16 7.62,12.7 10.16,12.7 8.89,10.16 8.89,11.43 7.62,11.43 10.16,11.43 8.89,12.7
  pour Top (isolate 0.127): 0,33.02 17.78,33.02 17.78,0 0,0
  pour Bottom (isolate 0.127): 0,33.02 17.78,33.02 17.78,0 0,0
  pour GND/Vert (isolate 0.127): 0,33.02 17.78,33.02 17.78,0 0,0
N$1  (via drill 0.2)
  Top 0.178: v17.14,30.86 17.14,32.13 16.86,32.41 U3.1
  Bottom 0.178: TP3.P$1 17.14,31.11 v17.14,30.86
N$9  (via drill 0.2)
  Top 0.127: J5.A5 10.14,27.92 v10.16,27.94 | v14.22,28.45 13.72,28.96 R3.2
  3.3V/Horz 0.127: v10.16,27.94 10.16,28.7 10.54,29.08 13.59,29.08 v14.22,28.45
N$10  (via drill 0.2)
  Top 0.127: J5.B5 7.14,27.71 v7.24,27.81 | R1.2 v6.21,29.34 v6.22,29.34
  Bottom 0.127: v7.24,27.81 7.24,28.32 v6.22,29.34
N$38
  Top 0.127: R11.1 3.81,24.76 3.81,28.7 2.16,30.35 1.92,30.35 LED1.A
QSPI-0  (via drill 0.2)
  Top 0.127: U2.53 7.49,14.44 7.31,14.26 7.31,13.87 v7.62,13.56 | v10.92,17.4 U4.5
  GND/Vert 0.127: v7.62,13.56 7.24,13.94 v7.24,17.4
  3.3V/Horz 0.127: v7.24,17.4 v10.92,17.4
QSPI-1  (via drill 0.2)
  Top 0.127: U2.55 6.69,14.06 v6.6,13.97 | v6.86,19.94 U4.2
  GND/Vert 0.127: v6.6,13.97 6.6,18.44 6.52,18.53 6.52,19.6 v6.86,19.94
QSPI-2  (via drill 0.2)
  Top 0.127: U2.54 7.09,14.37 7.08,14.35 7.08,13.68 v6.99,13.59 | v6.86,18.67 U4.3
  GND/Vert 0.127: v6.99,13.59 6.99,17.17 6.9,17.26 6.9,18.63 v6.86,18.67
QSPI-3  (via drill 0.2)
  Top 0.127: U2.51 8.29,14.01 v8.26,13.97 | v10.92,19.94 U4.7
  GND/Vert 0.127: v8.26,13.97 8.26,19.68 v8,19.94
  3.3V/Horz 0.127: v8,19.94 v10.92,19.94
QSPI-CLK  (via drill 0.2)
  Top 0.127: U2.52 7.89,14.25 v7.72,14.09 | v10.92,18.67 U4.6
  GND/Vert 0.127: v7.72,14.09 7.72,18.56 v7.62,18.67
  3.3V/Horz 0.127: v7.62,18.67 v10.92,18.67
QSPI-CS
  Top 0.127: U2.56 6.29,15.43 6.16,15.55 5.66,15.55 5.21,16 5.21,19.68 4.83,20.06 R15.1 R16.1 4.06,21.21 U4.1
RAW  (via drill 0.2)
  Top 0.127: J4.1B J4.1 16.51,30.23 U3.4
  Top 0.305: D2.C 7.79,25.28 U1.3 7.94,24.19 v8.06,24.07 8.26,23.88 9.78,23.88 | C7.2 10.8,24.13 10.55,23.88 9.78,23.88 | U1.1 9.78,25.37 9.78,23.88
  3.3V/Horz 0.305: v8.06,24.07 7.75,24.38 7.75,29.16 8.19,29.6 16.12,29.6 J4.1
RP_D1+  (via drill 0.2)
  Top 0.127: U2.47 9.89,13.86 v9.91,13.84 | R13.2 v12.7,24
  GND/Vert 0.127: v12.7,24 12.06,24 10.18,22.12 10.18,21.52 9.91,21.24 v9.91,13.84
RP_D1-  (via drill 0.2)
  Top 0.127: U2.46 10.29,13.91 v10.36,13.84 | v13.97,23.88 R12.2
  GND/Vert 0.127: v10.36,13.84 10.25,13.96 10.25,13.98 10.13,14.1 10.13,21.14 10.41,21.42 10.41,21.9 12.13,23.62 13.08,23.62 13.34,23.88 v13.97,23.88
RP_D+  (via drill 0.2)
  Top 0.127: R13.1 12.07,25.9 v12.06,25.91 | v8.26,27.94 8.14,27.82 J5.B6 8.13,27 8.13,26.42 8.27,26.27 8.97,26.27 9.14,26.45 J5.A6
  3.3V/Horz 0.127: v12.06,25.91 9.4,25.91 8.26,27.05 v8.26,27.94
  Bottom 0.127: JP14.D+ 8,28.19 v8.26,27.94
RP_D-  (via drill 0.2)
  Top 0.127: R12.1 v13.34,25.9 v13.34,25.91 | J5.B7 9.65,27.02 v9.65,27.94 8.89,27.94 8.64,27.69 J5.A7
  3.3V/Horz 0.127: v13.34,25.91 12.55,25.91 12.21,26.25 10.07,26.25 9.65,26.67 v9.65,27.94
  Bottom 0.127: JP14.D- 9.78,28.07 v9.65,27.94
SWDCK  (via drill 0.2)
  Top 0.127: U2.24 9.89,8.87 v9.91,8.89
  Bottom 0.127: TP1.P$1 7.62,6.6 v9.91,8.89
SWDIO  (via drill 0.2)
  Top 0.127: U2.25 10.29,8.77 v10.41,8.89
  Bottom 0.127: TP2.P$1 10.16,6.6 9.91,6.86 9.91,8.38 v10.41,8.89
USB_RAW
  Top 0.305: F1.2 6.35,23.23 D2.A
V_USB  (via drill 0.2)
  Top 0.305: F1.1 5.16,25.03 6.05,25.93 6.22,25.93 6.44,26.14 J5.VBUS2 6.44,27.66 6.63,27.85 6.63,28.22 7.11,28.7 11.05,28.7 v11.15,28.6 11.15,27.85 11.34,27.66 J5.VBUS1 11.34,25.95 10.93,25.54 C6.2
  Bottom 0.305: v11.15,28.6 11.15,28.86 11.49,29.2 11.49,31.3 JP14.VBUS
X1A
  Top 0.127: U2.21 8.69,7.39 8.56,7.26 8.07,7.26 7.87,7.06 7.87,6.27 7.7,6.1 R10.2
X1B
  Top 0.127: Y1.P1 3.68,5.33 5.6,5.33 | R10.1 5.6,5.33 | 5.6,5.33 C11.2
X2  (via drill 0.2)
  Top 0.127: U2.20 8.29,8.67 v8.38,8.76 | v4.57,8.76 4.57,7.6 Y1.P3 5.01,7.57 C13.2
  3.3V/Horz 0.127: v8.38,8.76 v4.57,8.76

### Text on the board
Bottom: v11
Measures: Units in Inches
tDocu: 0.8mm PCB | N Seidle